# Altium schematic sheet Top.SchDoc
size C
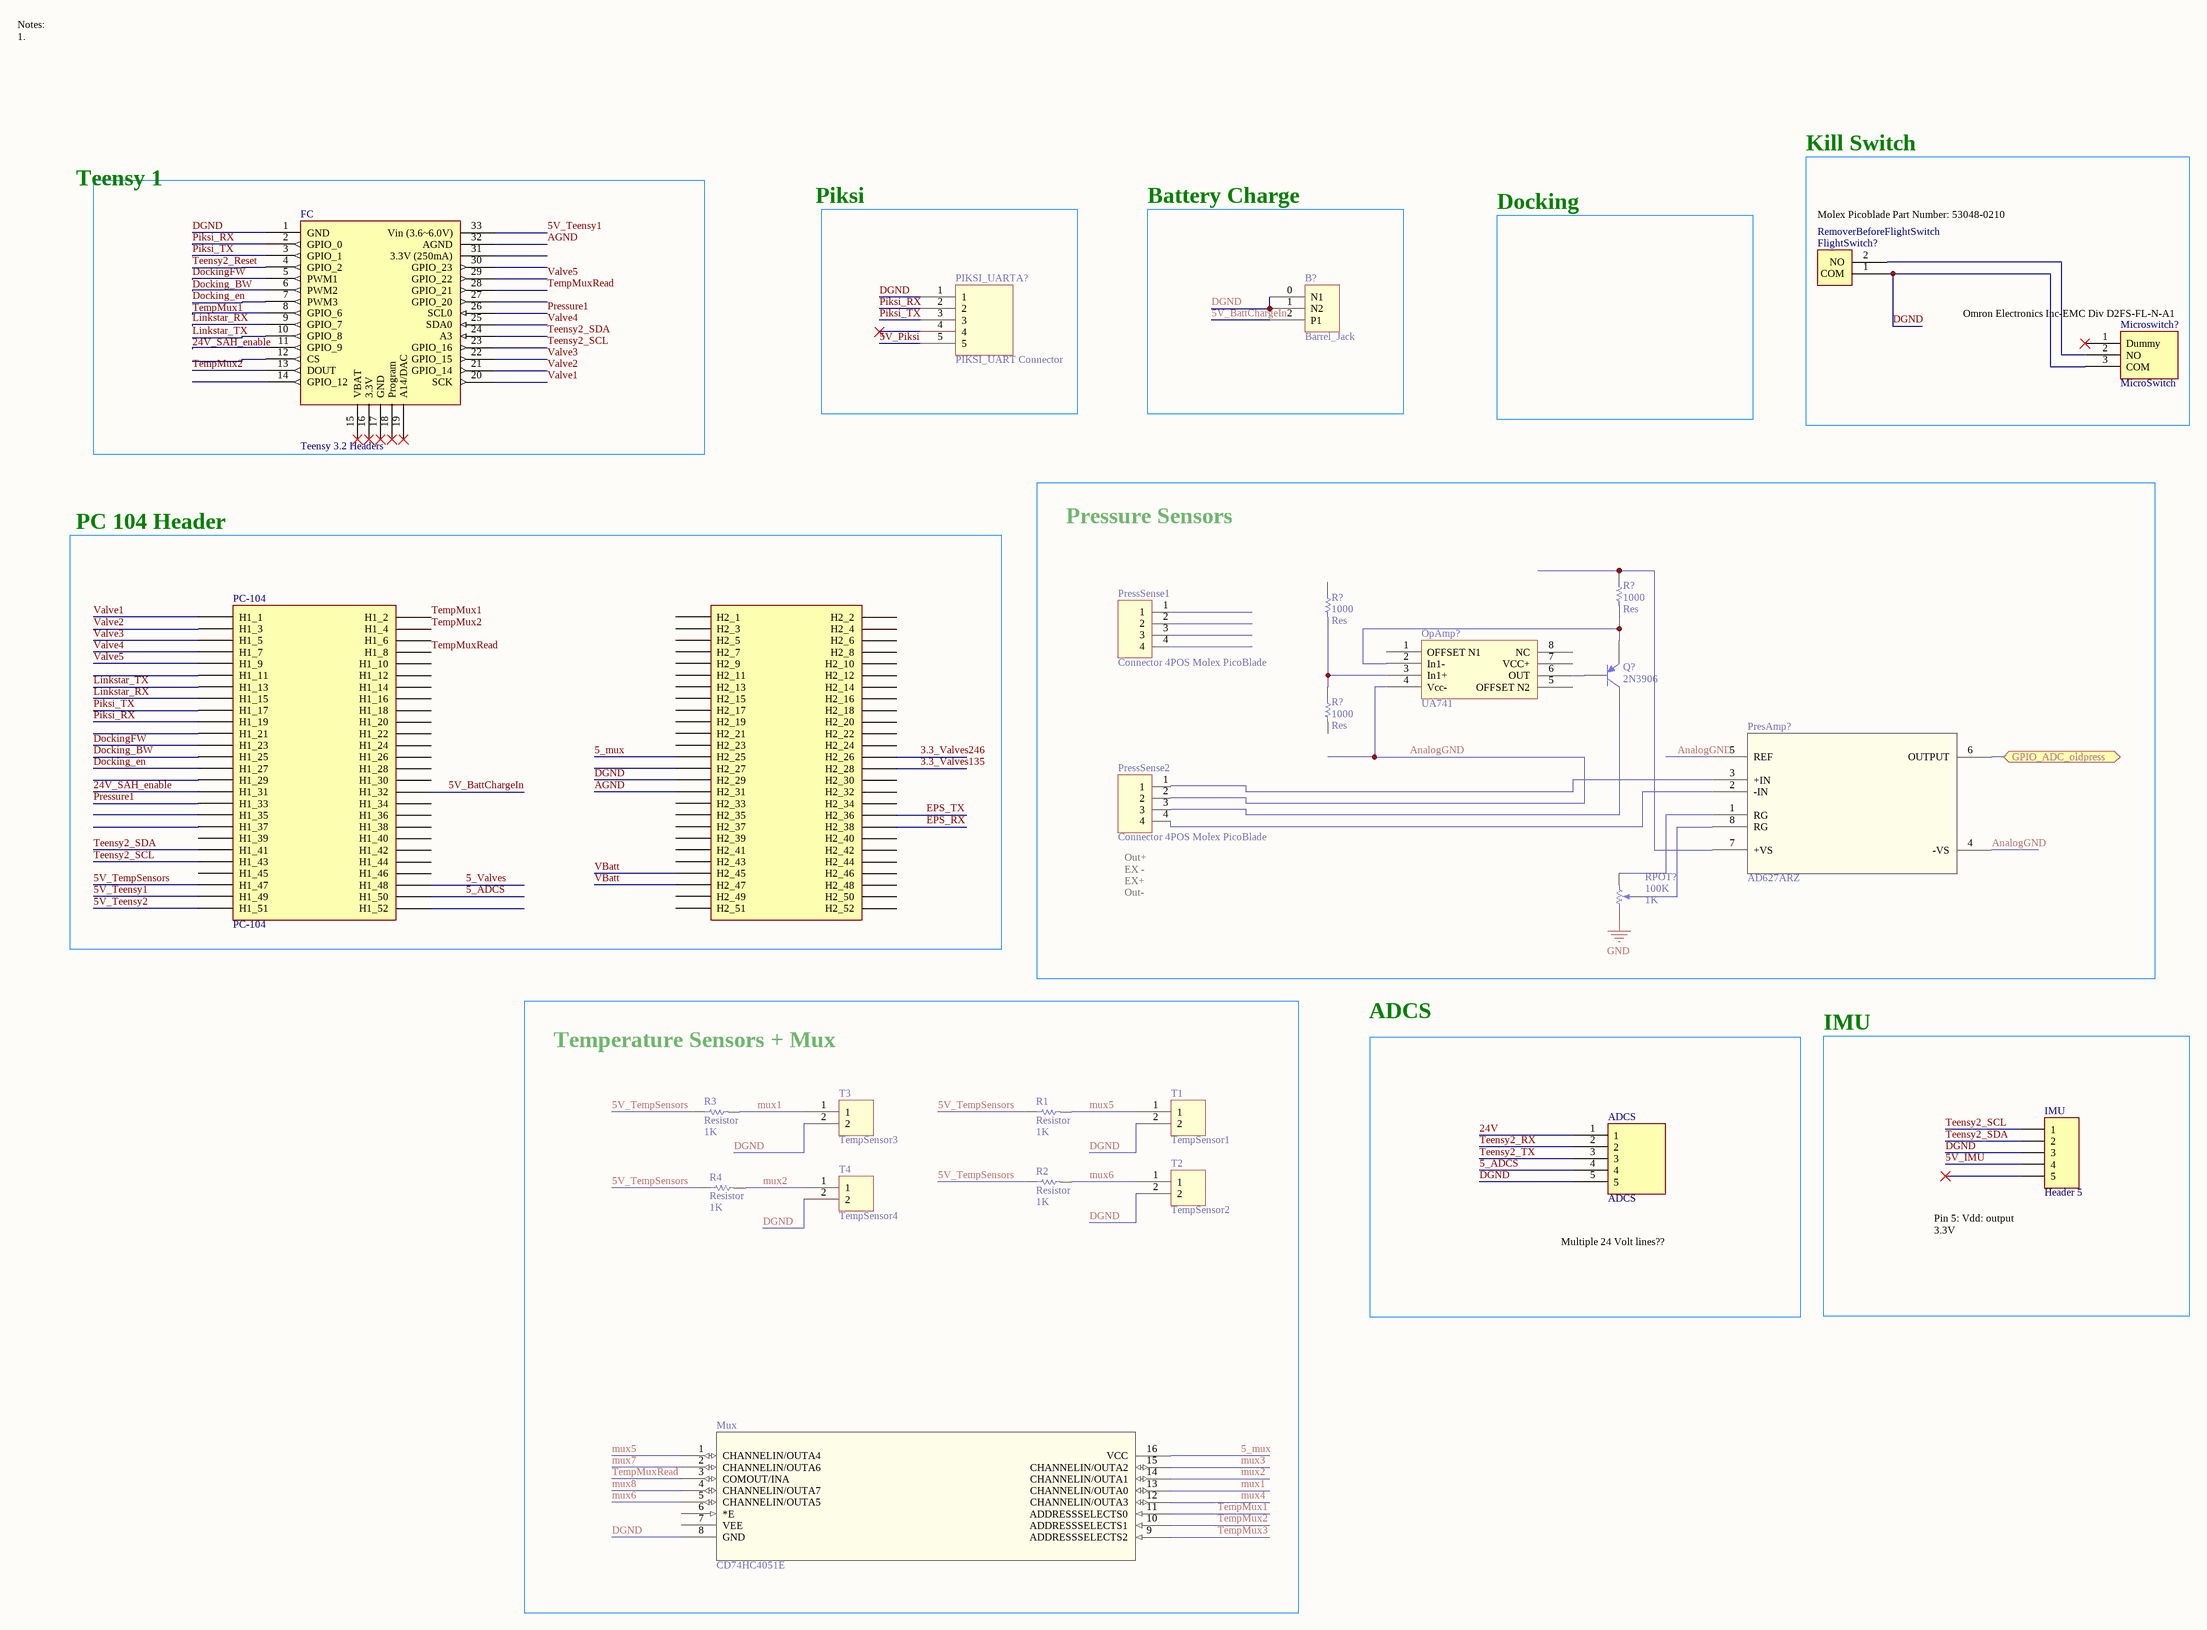
[diagram p0: Top.SchDoc]

## Parts
(Parts that share a designator on the sheet are numbered #1, #2 ... from top to bottom, then left to right.)
ADCS  ADCS  [Molex Picoblade 5 Pin]
B?  Barrel_Jack  [Barrel_Jack]
FC  Teensy 3.2 Headers  [Teensy 3.2 SMD Headers]
FlightSwitch?  RemoverBeforeFlightSwitch  [RemoverBeforeFlight Switch]
IMU  Header 5  [HDR1X5]
Microswitch?  MicroSwitch  [MicroSwitch_3pin]
Mux  CD74HC4051E  [N16]
OpAmp?  UA741  [UA741]
PC-104  PC-104  [PC-104FOOTPRINT]
PIKSI_UARTA?  PIKSI_UART Connector  [Molex Picoblade 5 Pin]
PresAmp?  AD627ARZ  [R_8]
PressSense1  Connector 4POS Molex PicoBlade  [532610471]
PressSense2  Connector 4POS Molex PicoBlade  [532610471]
Q?  2N3906  [TO-92A]
R1  Resistor  value 1K  [AXIAL-0.3]
R2  Resistor  value 1K  [AXIAL-0.3]
R3  Resistor  value 1K  [AXIAL-0.3]
R4  Resistor  value 1K  [AXIAL-0.3]
R?#1  1000  value Res  [AXIAL-0.3]
R?#2  1000  value Res  [AXIAL-0.3]
R?#3  1000  value Res  [AXIAL-0.3]
RPOT?  100K  value 1K  [VR5]
T1  TempSensor1  [RemoverBeforeFlight Switch]
T2  TempSensor2  [RemoverBeforeFlight Switch]
T3  TempSensor3  [RemoverBeforeFlight Switch]
T4  TempSensor4  [RemoverBeforeFlight Switch]

## Blocks framed on the sheet
Kill Switch: FlightSwitch? Microswitch?
Battery Charge: B?
Pressure Sensors: OpAmp? PresAmp? PressSense1 PressSense2 Q? R?#1-R?#3 RPOT?
PC 104 Header: PC-104
Temperature Sensors + Mux: Mux R1-R4 T1-T4
ADCS: ADCS
IMU: IMU

## Ports
GPIO_ADC_oldpress (bidir)

## Nets
GND: RPOT?.1(TOP)
3.3_Valves135: PC-104.H2_28
3.3_Valves246: PC-104.H2_26
5_ADCS: ADCS.4 PC-104.H1_50
5_mux: Mux.16(VCC) PC-104.H2_25
5_Valves: PC-104.H1_48
5V_BattChargeIn: B?.2(P1) PC-104.H1_32
5V_IMU: IMU.4
5V_Piksi: PIKSI_UARTA?.5
5V_Teensy1: FC.33(Vin_(3.6~6.0V)) PC-104.H1_49
5V_Teensy2: PC-104.H1_51
5V_TempSensors: PC-104.H1_47 R1.1 R2.1 R3.1 R4.1
24V: ADCS.1
24V_SAH_enable: FC.11(GPIO_9) PC-104.H1_31
AGND: FC.32(AGND) PC-104.H2_31
AnalogGND: OpAmp?.4(Vcc-) PresAmp?.4(-VS) PresAmp?.5(REF) PressSense2.2
DGND: ADCS.5 B?.0(N1) B?.1(N2) FC.1(GND) FlightSwitch?.1(COM) IMU.3 Microswitch?.3(COM) Mux.8(GND) PC-104.H2_29 PIKSI_UARTA?.1 T1.2 T2.2 T3.2 T4.2
Docking_BW: FC.6(PWM2) PC-104.H1_25
Docking_en: FC.7(PWM3) PC-104.H1_27
DockingFW: FC.5(PWM1) PC-104.H1_23
EPS_RX: PC-104.H2_38
EPS_TX: PC-104.H2_36
GPIO_ADC_oldpress: PresAmp?.6(OUTPUT) ; port GPIO_ADC_oldpress
Linkstar_RX: FC.9(GPIO_7) PC-104.H1_15
Linkstar_TX: FC.10(GPIO_8) PC-104.H1_13
mux1: Mux.13(CHANNELIN/OUTA0) R3.2 T3.1
mux2: Mux.14(CHANNELIN/OUTA1) R4.2 T4.1
mux3: Mux.15(CHANNELIN/OUTA2)
mux4: Mux.12(CHANNELIN/OUTA3)
mux5: Mux.1(CHANNELIN/OUTA4) R1.2 T1.1
mux6: Mux.5(CHANNELIN/OUTA5) R2.2 T2.1
mux7: Mux.2(CHANNELIN/OUTA6)
mux8: Mux.4(CHANNELIN/OUTA7)
Piksi_RX: FC.2(GPIO_0) PC-104.H1_19 PIKSI_UARTA?.2
Piksi_TX: FC.3(GPIO_1) PC-104.H1_17 PIKSI_UARTA?.3
Pressure1: FC.26(SCL0) PC-104.H1_33
Teensy2_Reset: FC.4(GPIO_2)
Teensy2_RX: ADCS.2
Teensy2_SCL: FC.23(GPIO_16) IMU.1 PC-104.H1_43
Teensy2_SDA: FC.24(A3) IMU.2 PC-104.H1_41
Teensy2_TX: ADCS.3
TempMux1: FC.8(GPIO_6) Mux.11(ADDRESSSELECTS0) PC-104.H1_2
TempMux2: FC.13(DOUT) Mux.10(ADDRESSSELECTS1) PC-104.H1_4
TempMux3: Mux.9(ADDRESSSELECTS2)
TempMuxRead: FC.28(GPIO_21) Mux.3(COMOUT/INA) PC-104.H1_8
Valve1: FC.20(SCK) PC-104.H1_1
Valve2: FC.21(GPIO_14) PC-104.H1_3
Valve3: FC.22(GPIO_15) PC-104.H1_5
Valve4: FC.25(SDA0) PC-104.H1_7
Valve5: FC.29(GPIO_22) PC-104.H1_9
VBatt: PC-104.H2_45 PC-104.H2_47
NetFlightSwitch?_2: FlightSwitch?.2(NO) Microswitch?.2(NO)
NetOpAmp?_2: OpAmp?.2(In1-) Q?.1(E) R?#1.2
NetOpAmp?_3: OpAmp?.3(In1+) R?#2.2 R?#3.1
NetOpAmp?_6: OpAmp?.6(OUT) Q?.2(B)
NetPresAmp?_1: PresAmp?.1(RG) RPOT?.2(BOT)
NetPresAmp?_2: PresAmp?.2(-IN) PressSense2.4
NetPresAmp?_7: PresAmp?.7(+VS) R?#1.1
NetPresAmp?_8: PresAmp?.8(RG) RPOT?.3(TAP)
NetPressSense2_3: PressSense2.3 Q?.3(C)

Not connected (* = marked no-connect by the designer): FC 12(CS) 14(GPIO_12) 15(VBAT)* 16(3.3V)* 17(GND)* 18(Program)* 19(A14/DAC)* 27(GPIO_20) 30(GPIO_23) 31(3.3V_(250mA)); IMU 5*; Microswitch? 1(Dummy)*; Mux 6(*E) 7(VEE); OpAmp? 1(OFFSET_N1) 5(OFFSET_N2) 7(VCC+) 8(NC); PC-104 H1_6 H1_10 H1_11 H1_12 H1_14 H1_16 H1_18 H1_20 H1_21 H1_22 H1_24 H1_26 H1_28 H1_29 H1_30 H1_34 H1_35 H1_36 H1_37 H1_38 H1_39 H1_40 H1_42 H1_44 H1_45 H1_46 H1_52 H2_1 H2_2 H2_3 H2_4 H2_5 H2_6 H2_7 H2_8 H2_9 H2_10 H2_11 H2_12 H2_13 H2_14 H2_15 H2_16 H2_17 H2_18 H2_19 H2_20 H2_21 H2_22 H2_23 H2_24 H2_27 H2_30 H2_32 H2_33 H2_34 H2_35 H2_37 H2_39 H2_40 H2_41 H2_42 H2_43 H2_44 H2_46 H2_48 H2_49 H2_50 H2_51 H2_52; PIKSI_UARTA? 4*; PresAmp? 3(+IN); PressSense1 1 2 3 4; PressSense2 1; R?#2 1; R?#3 2

## Notes on the sheet
- Notes:
  1.
- Teensy 1
- Piksi
- Docking
- (near FlightSwitch?) Molex Picoblade Part Number: 53048-0210
- (near Microswitch?) Omron Electronics Inc-EMC Div D2FS-FL-N-A1
- (near PressSense2) Out+
  EX -
  EX+
  Out-
- Multiple 24 Volt lines??
- (near IMU) Pin 5: Vdd: output 3.3V

## Library data of the parts
ADCS PIKSI_UARTA? = PIKSI_UART Connector: Molex Picoblade 53261-0571
FlightSwitch? T1-T4 = RemoverBeforeFlightSwitch: 53048-0210 Molex Picoblade
IMU = Header 5: Header, 5-Pin; LatestRevisionDate: 17-Jul-2002; LatestRevisionNote: Re-released for DXP Platform.; Publisher: Altium Limited
Microswitch? = MicroSwitch: Omron Electronics Inc-EMC Div D2FS-FL-N-A1
Mux = CD74HC4051E: Imported; Vendor: Texas Instruments; Section: Unknown; C: Copyright (C) 2015 Accelerated Designs. All rights reserved; Manufacturer_Part_Number: CD74HC4051E; Family: Unknown; Manufacturer_Name: Texas Instruments; Copyright: Copyright (C) 2015 Accelerated Designs. All rights reserved; RS_Part_Number: 526694; Value: Value; Type: Type; RefDes: RefDes
PC-104 = PC-104: ESQ-126-14-G-D (2 total needed)
PresAmp? = AD627ARZ: Imported; Manufacturer_Part_Number: AD627ARZ; Vendor: Vendor; RefDes: Refdes; Type: Type; Value: Value
PressSense1 PressSense2 = 532610471
Q? = 2N3906: PNP General Purpose Amplifier; Published: 8-Jun-2000; LatestRevisionDate: 15-Jan-2003; LatestRevisionNote: PCB Footprint 'BCY-W3/D4.7' replaced; DatasheetVersion: 1997; PackageVersion: Sep-1998; PackageReference: TO-92A; Publisher: Altium Limited; PackageDescription: TO, Flat Index; 3 In-Line, Axial Leads; Body Dia. 4.5mm; Leads 0.51 x 0.48 mm (max); ComponentLink1Description: Manufacturer Link; ComponentLink1URL: http://www.fairchildsemi.com/; ComponentLink2Description: Datasheet; ComponentLink2URL: http://www.fairchildsemi.com/ds/2N%2F2N3906.pdf
R1-R4 = Res1: Published: 8-Jun-2000; LatestRevisionDate: 17-Jul-2002; LatestRevisionNote: Re-released for DXP Platform.; PackageReference: AXIAL-0.3; Publisher: Altium Limited; PackageDescription: Axial Device, Thru-Hole; 2 Leads; 0.3 in Pin Spacing
R?#1-R?#3 = Res1: Resistor- 696-1552-ND; Published: 8-Jun-2000; LatestRevisionDate: 17-Jul-2002; LatestRevisionNote: Re-released for DXP Platform.; PackageReference: AXIAL-0.3; Publisher: Altium Limited; PackageDescription: Axial Device, Thru-Hole; 2 Leads; 0.3 in Pin Spacing
RPOT? = RPot: Potentiometer; Sim Note: Enter the Resistance value and the set point into parameter fields.; Set Position: 0.5; Published: 8-Jun-2000; LatestRevisionDate: 17-Jul-2002; LatestRevisionNote: Re-released for DXP Platform.; PackageReference: VR5; Publisher: Altium Limited; PackageDescription: Variable Resistor, Thru-Hole; 3 Leads